# Altium schematic sheet 主控.SchDoc
size A3
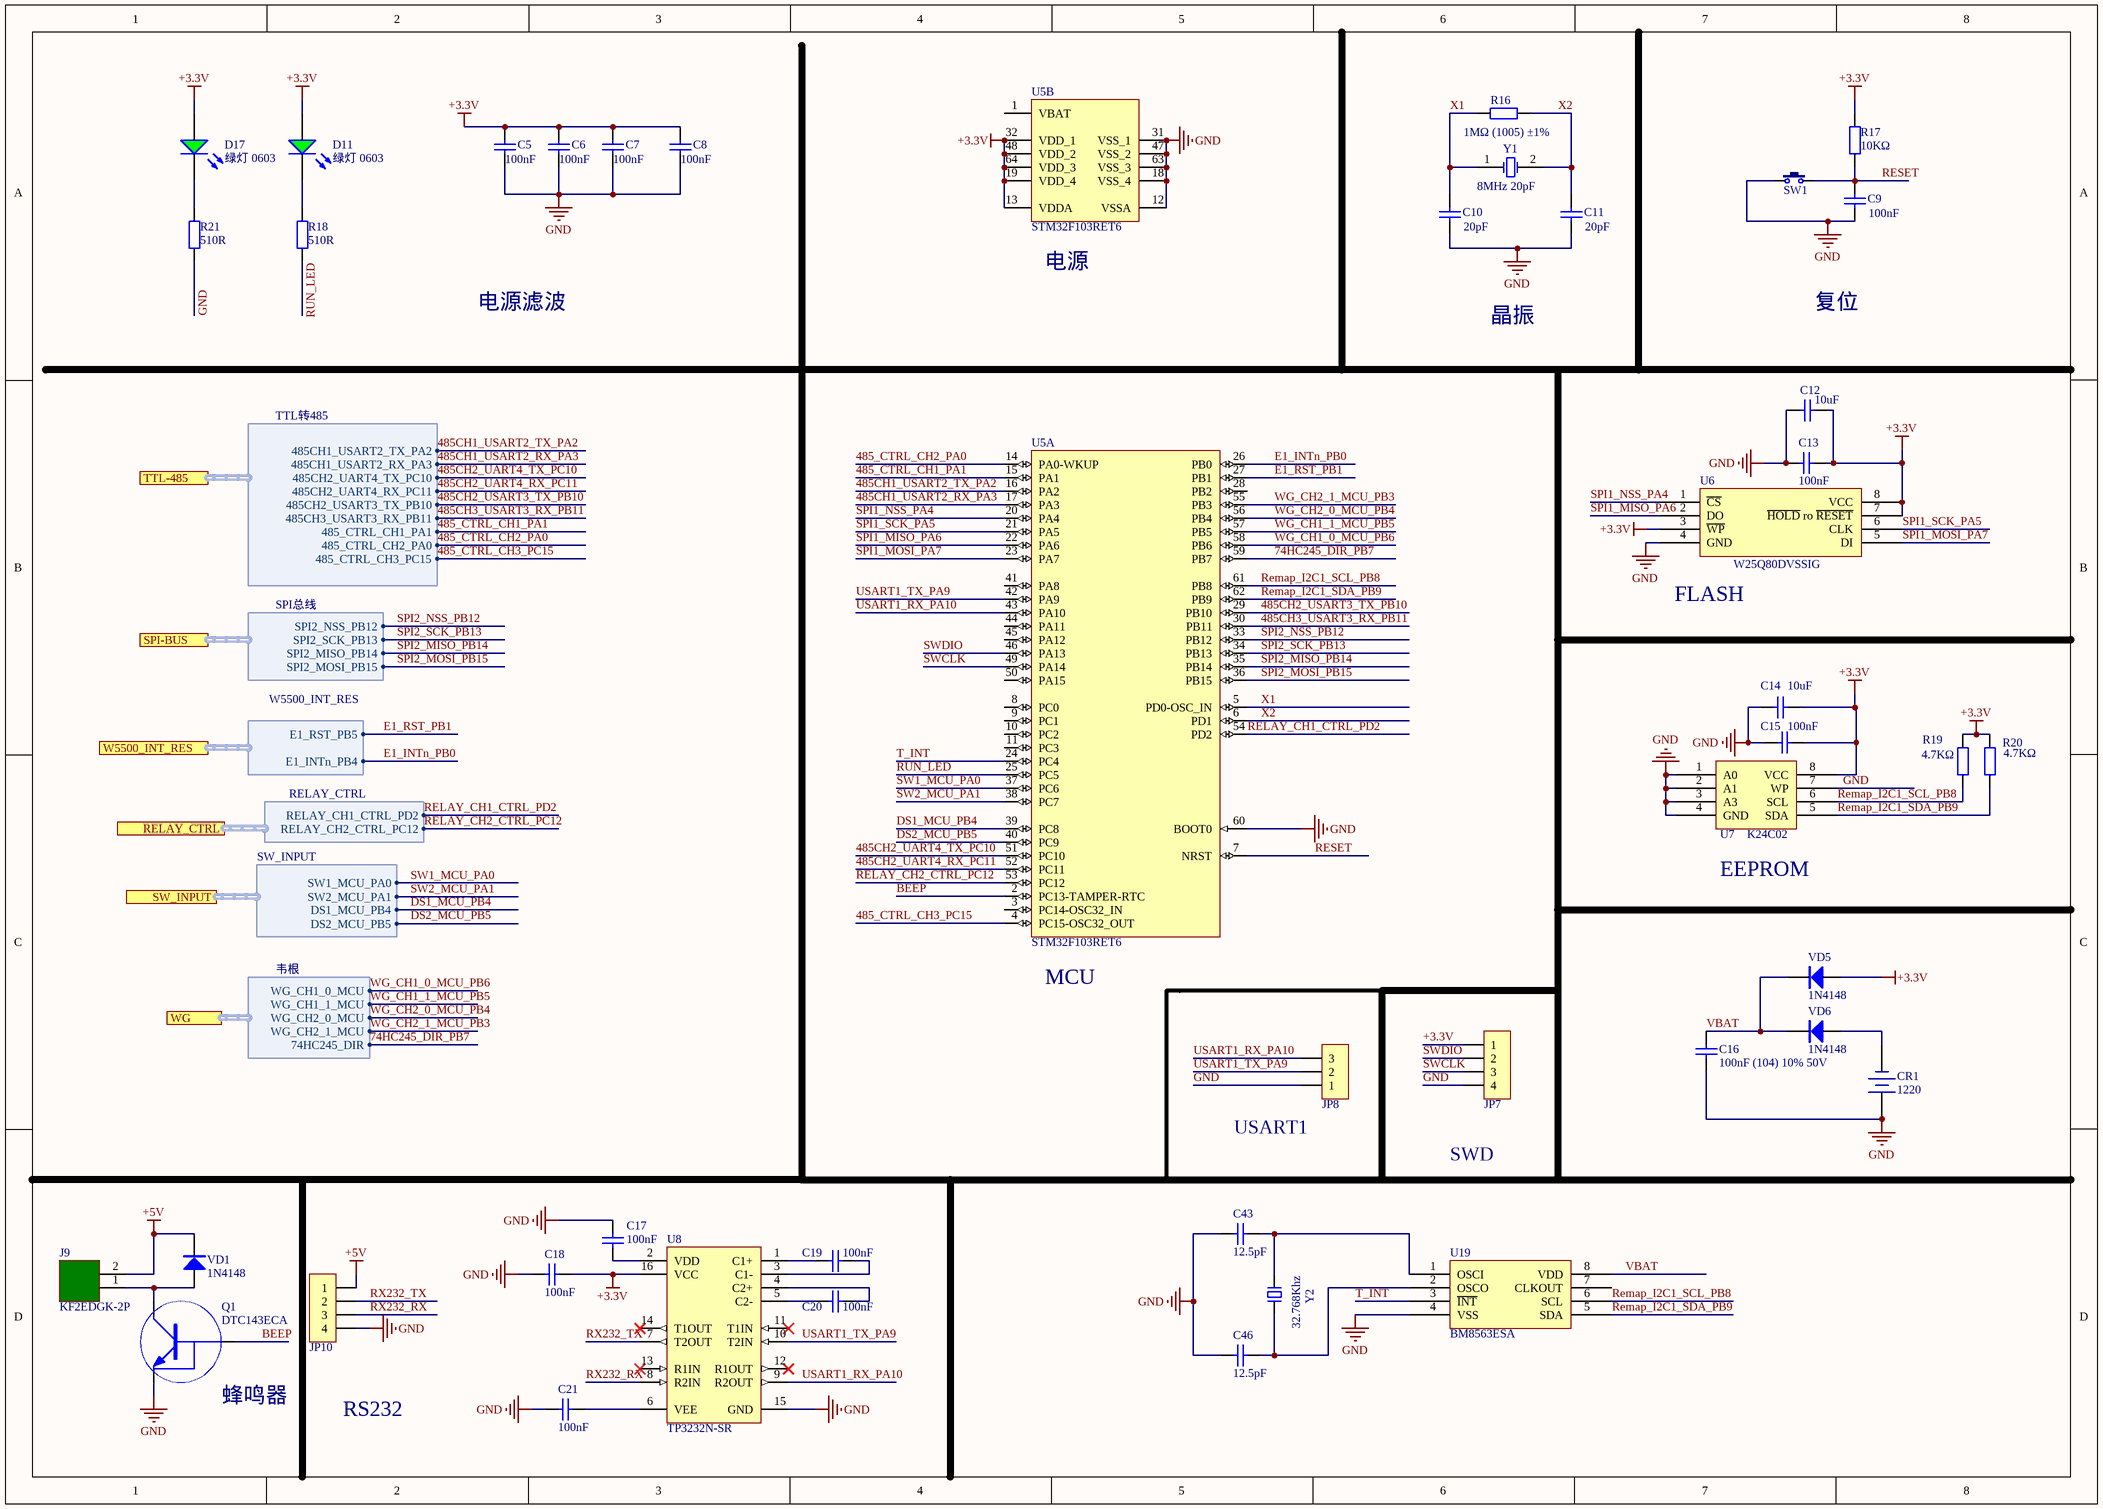
[diagram p0: 主控.SchDoc]

## Parts
C5  100nF  [0603_C]
C6  100nF  [0603_C]
C7  100nF  [0603_C]
C8  100nF  [0603_C]
C9  100nF  [0603_C]
C10  20pF  [0603_C]
C11  20pF  [0603_C]
C12  10uF  [0603_C]
C13  100nF  [0603_C]
C14  10uF  [0603_C]
C15  100nF  [0603_C]
C16  100nF (104) 10% 50V  [0603_C]
C17  100nF  [0603_C]
C18  100nF  [0603_C]
C19  100nF  [0603_C]
C20  100nF  [0603_C]
C21  100nF  [0603_C]
C43  12.5pF  [0603_C]
C46  12.5pF  [0603_C]
CR1  1220  [CR1220_A]
D11  绿灯 0603  [0603_LED_S1]
D17  绿灯 0603  [0603_LED_S1]
J9  KF2EDGK-2P  [KF2EDGK5.08W-2P]
JP7  HDR-1X4  [HDR-1X4_H]  (value not drawn)
JP8  HDR-1X3  [HDR-1X3_H]  (value not drawn)
JP10  HDR-1X4  [HDR-1X4]  (value not drawn)
Q1  DTC143ECA
R16  1MΩ (1005) ±1%  [0603_R]
R17  10KΩ  [0603_R]
R18  510R  [0603_R]
R19  4.7KΩ  [0603_R]
R20  4.7KΩ  [0603_R]
R21  510R  [0603_R]
SW1  3x6x5  [TSW SMD-3*6*4.3]  (value not drawn)
U5  STM32F103RET6  [LQFP-64_10x10x05P]  (parts A,B of 2)
U6  W25Q80DVSSIG  [SOIC-8_208mil]
U7  K24C02  [SOIC-8_150mil]
U8  TP3232N-SR  [SOIC-16_150mil]
U19  BM8563ESA  [SOIC-8_150mil]
VD1  1N4148  [MINI_MELF (LL34)]
VD5  1N4148  [MINI_MELF (LL34)]
VD6  1N4148  [MINI_MELF (LL34)]
Y1  8MHz 20pF  [XTAL-49S DIP]
Y2  32.768Khz  [XTAL-3215]

## Ports
RELAY_CTRL (harness RELAY_CTRL), SPI-BUS (harness SPI总线), SW_INPUT (harness SW_INPUT), TTL-485 (harness TTL转485), W5500_INT_RES (harness W5500_INT_RES), WG (harness 韦根)

## Harnesses
TTL转485: 485CH1_USART2_TX_PA2, 485CH1_USART2_RX_PA3, 485CH2_UART4_TX_PC10, 485CH2_UART4_RX_PC11, 485CH2_USART3_TX_PB10, 485CH3_USART3_RX_PB11, 485_CTRL_CH1_PA1, 485_CTRL_CH2_PA0, 485_CTRL_CH3_PC15
SPI总线: SPI2_NSS_PB12, SPI2_SCK_PB13, SPI2_MISO_PB14, SPI2_MOSI_PB15
W5500_INT_RES: E1_RST_PB5, E1_INTn_PB4
RELAY_CTRL: RELAY_CH1_CTRL_PD2, RELAY_CH2_CTRL_PC12
SW_INPUT: SW1_MCU_PA0, SW2_MCU_PA1, DS1_MCU_PB4, DS2_MCU_PB5
韦根: WG_CH1_0_MCU, WG_CH1_1_MCU, WG_CH2_1_MCU, 74HC245_DIR, WG_CH2_0_MCU

## Nets
+3.3V: C5.2 C6.2 C7.2 C8.2 C12.2 C13.1 C14.2 C15.1 C18.2 D11.A D17.A JP7.1 R17.1 R19.2 R20.2 U5.13(VDDA) U5.19(VDD_4) U5.32(VDD_1) U5.48(VDD_2) U5.64(VDD_3) U6.3(~{WP}) U6.7(~{HOLD}_ro_~{RESET}) U6.8(VCC) U7.8(VCC) U8.16(VCC) VD5.1(A)
+5V: J9.2 JP10.1 VD1.2(K)
GND: C5.1 C6.1 C7.1 C8.1 C9.1 C10.1 C11.1 C12.1 C13.2 C14.1 C15.2 C16.1 C17.2 C18.1 C21.1 C43.1 C46.1 CR1.1(DC+) JP7.4 JP8.1 JP10.4 Q1.2(GND) R21.1 SW1.1 U5.12(VSSA) U5.18(VSS_4) U5.31(VSS_1) U5.47(VSS_2) U5.60(BOOT0) U5.63(VSS_3) U6.4(GND) U7.1(A0) U7.2(A1) U7.3(A3) U7.4(GND) U7.7(WP) U8.15(GND) U19.4(VSS)
74HC245_DIR_PB7: U5.59(PB7) ; port WG.74HC245_DIR
485_CTRL_CH1_PA1: U5.15(PA1) ; port TTL-485.485_CTRL_CH1_PA1
485_CTRL_CH2_PA0: U5.14(PA0-WKUP) ; port TTL-485.485_CTRL_CH2_PA0
485_CTRL_CH3_PC15: U5.4(PC15-OSC32_OUT) ; port TTL-485.485_CTRL_CH3_PC15
485CH1_USART2_RX_PA3: U5.17(PA3) ; port TTL-485.485CH1_USART2_RX_PA3
485CH1_USART2_TX_PA2: U5.16(PA2) ; port TTL-485.485CH1_USART2_TX_PA2
485CH2_UART4_RX_PC11: U5.52(PC11) ; port TTL-485.485CH2_UART4_RX_PC11
485CH2_UART4_TX_PC10: U5.51(PC10) ; port TTL-485.485CH2_UART4_TX_PC10
485CH2_USART3_TX_PB10: U5.29(PB10) ; port TTL-485.485CH2_USART3_TX_PB10
485CH3_USART3_RX_PB11: U5.30(PB11) ; port TTL-485.485CH3_USART3_RX_PB11
BEEP: Q1.1(IN) U5.2(PC13-TAMPER-RTC)
DS1_MCU_PB4: U5.39(PC8) ; port SW_INPUT.DS1_MCU_PB4
DS2_MCU_PB5: U5.40(PC9)
E1_INTn_PB0: U5.26(PB0) ; port W5500_INT_RES.E1_INTn_PB4
E1_RST_PB1: U5.27(PB1) ; port W5500_INT_RES.E1_RST_PB5
RELAY_CH1_CTRL_PD2: U5.54(PD2) ; port RELAY_CTRL.RELAY_CH1_CTRL_PD2
RELAY_CH2_CTRL_PC12: U5.53(PC12) ; port RELAY_CTRL.RELAY_CH2_CTRL_PC12
Remap_I2C1_SCL_PB8: R19.1 U5.61(PB8) U7.6(SCL) U19.6(SCL)
Remap_I2C1_SDA_PB9: R20.1 U5.62(PB9) U7.5(SDA) U19.5(SDA)
RESET: C9.2 R17.2 SW1.2 U5.7(NRST)
RUN_LED: R18.1 U5.25(PC5)
RX232_RX: JP10.3 U8.8(R2IN)
RX232_TX: JP10.2 U8.7(T2OUT)
SPI1_MISO_PA6: U5.22(PA6) U6.2(DO)
SPI1_MOSI_PA7: U5.23(PA7) U6.5(DI)
SPI1_NSS_PA4: U5.20(PA4) U6.1(~{CS})
SPI1_SCK_PA5: U5.21(PA5) U6.6(CLK)
SPI2_MISO_PB14: U5.35(PB14) ; port SPI-BUS.SPI2_MISO_PB14
SPI2_MOSI_PB15: U5.36(PB15) ; port SPI-BUS.SPI2_MOSI_PB15
SPI2_NSS_PB12: U5.33(PB12) ; port SPI-BUS.SPI2_NSS_PB12
SPI2_SCK_PB13: U5.34(PB13) ; port SPI-BUS.SPI2_SCK_PB13
SW1_MCU_PA0: U5.37(PC6)
SW2_MCU_PA1: U5.38(PC7) ; port SW_INPUT.SW2_MCU_PA1
SWCLK: JP7.3 U5.49(PA14)
SWDIO: JP7.2 U5.46(PA13)
T_INT: U5.24(PC4) U19.3(~{INT})
USART1_RX_PA10: JP8.3 U5.43(PA10) U8.9(R2OUT)
USART1_TX_PA9: JP8.2 U5.42(PA9) U8.10(T2IN)
VBAT: C16.2 U19.8(VDD) VD5.2(K) VD6.2(K)
WG_CH1_0_MCU_PB6: U5.58(PB6) ; port WG.WG_CH1_0_MCU
WG_CH1_1_MCU_PB5: U5.57(PB5) ; port WG.WG_CH1_1_MCU
WG_CH2_0_MCU_PB4: U5.56(PB4) ; port WG.WG_CH2_0_MCU
WG_CH2_1_MCU_PB3: U5.55(PB3) ; port WG.WG_CH2_1_MCU
X1: C10.2 R16.1 U5.5(PD0-OSC_IN) Y1.1(OSC1)
X2: C11.2 R16.2 U5.6(PD1) Y1.2(OSC2)
NetC17_1: C17.1 U8.2(VDD)
NetC19_1: C19.1 U8.1(C1+)
NetC19_2: C19.2 U8.3(C1-)
NetC20_1: C20.1 U8.5(C2-)
NetC20_2: C20.2 U8.4(C2+)
NetC21_2: C21.2 U8.6(VEE)
NetC43_2: C43.2 U19.1(OSCI) Y2.1
NetC46_2: C46.2 U19.2(OSCO) Y2.2
NetCR1_2: CR1.2(DC-) VD6.1(A)
NetD11_K: D11.K R18.2
NetD17_K: D17.K R21.2
NetJ9_1: J9.1 Q1.3(OUT) VD1.1(A)

Not connected (* = marked no-connect by the designer): U5 1(VBAT) 3(PC14-OSC32_IN) 8(PC0) 9(PC1) 10(PC2) 11(PC3) 28(PB2) 41(PA8) 44(PA11) 45(PA12) 50(PA15); U8 11(T1IN)* 12(R1OUT)* 13(R1IN)* 14(T1OUT)*; U19 7(CLKOUT)

## Notes on the sheet
- 电源滤波
- (near U5) 电源
- 复位
- 晶振
- (near U6) FLASH
- (near U7) EEPROM
- (near U5) MCU
- (near JP8) USART1
- SWD
- (near Q1) 蜂鸣器
- RS232
- Labels drawn without touching a wire or pin: DS2_MCU_PB5, SW1_MCU_PA0

## Library data of the parts
C5-C9 C13 C15-C21 = 0603 100nF (104) 10% 50V: 贴片电容; ComponentLink1Description: 供应商链接; ComponentLink1URL: http://www.szlcsc.com/product/details_15331.html; Package: 0603; Supplier: LC; SuppliersPartNumber: C14663
C10 C11 = 0603 6pF (6R0) 0.25pF 50V: 贴片电容; ComponentLink1Description: 供应商链接; ComponentLink1URL: http://www.szlcsc.com/product/details_38453.html; Package: 0603; Supplier: LC; SuppliersPartNumber: C37474
C12 C14 = 0603 10uF (106) 10% 10V: 贴片电容; ComponentLink1Description: 供应商链接; ComponentLink1URL: http://www.szlcsc.com/product/details_20411.html; Package: 0603; Supplier: LC; SuppliersPartNumber: C19702
C43 C46 = 0603 12pF (120) 5% 50V: 贴片电容; ComponentLink1Description: 供应商链接; ComponentLink1URL: http://www.szlcsc.com/product/details_39506.html; Package: 0603; Supplier: LC; SuppliersPartNumber: C38523
CR1 = CR-3V: 微型电池; 版权归属: 源创客; BOM名称: 微型电池; 学习资源: www.ooocke.com
D11 D17 = 0603 绿灯: 发光二极管; ComponentLink1Description: 供应商链接; ComponentLink1URL: http://www.szlcsc.com/product/details_73152.html; Package: 0603; Supplier: LC; SuppliersPartNumber: C72043
JP7 JP10 = Header 4: 4P接插件; 版权归属: 源创客; BOM名称: 4P接插件; 学习资源: www.ooocke.com
JP8 = Header 3: 3P接插件; 版权归属: 源创客; BOM名称: 3P接插件; 学习资源: www.ooocke.com
Q1 = DTC143ECA: NPN集成三极管; ComponentLink1Description: 供应商; ComponentLink1URL: https://item.szlcsc.com/14526.html
R16 = 0603 10MΩ (1005) 1%: 贴片电阻; ComponentLink1Description: 供应商链接; ComponentLink1URL: http://www.szlcsc.com/product/details_7726.html; Package: 0603; Supplier: LC; SuppliersPartNumber: C7250
R17 = 0603 10KΩ (1002) 1%: 贴片电阻; ComponentLink1Description: 供应商链接; ComponentLink1URL: http://www.szlcsc.com/product/details_26547.html; Package: 0603; Supplier: LC; SuppliersPartNumber: C25804
R18 R21 = 0603 2KΩ (2001) 1%: 贴片电阻; ComponentLink1Description: 供应商链接; ComponentLink1URL: http://www.szlcsc.com/product/details_23702.html; Package: 0603; Supplier: LC; SuppliersPartNumber: C22975
R19 R20 = 0603 4.7KΩ (4701) 1%: 贴片电阻; ComponentLink1Description: 供应商链接; ComponentLink1URL: http://www.szlcsc.com/product/details_23889.html; Package: 0603; Supplier: LC; SuppliersPartNumber: C23162
SW1 = TSW 3x6: 3x6轻触开关; 版权归属: 源创客; BOM名称: 3x6轻触开关; 学习资源: www.ooocke.com
U5 = STM32F103RET6: ARM; ComponentLink1Description: 供应商链接; ComponentLink1URL: http://www.szlcsc.com/product/details_8814.html; Package: LQFP-64_10x10x05P; Supplier: LC; SuppliersPartNumber: C8322
U6 = W25Q128FVSIG: Flash ROM; ComponentLink1Description: 供应商链接; ComponentLink1URL: http://www.szlcsc.com/product/details_36072.html; Package: SOIC-8; Supplier: LC; SuppliersPartNumber: C35101; ComponentLink2Description: 华邦; ComponentLink2URL: https://item.szlcsc.com/14743.html
U7 = EEPROM/AT24C256C-SSHL-T: EEPROM; ComponentLink1Description: 供应商链接; ComponentLink1URL: http://www.szlcsc.com/product/details_6947.html; Package: SOIC-8_150mil; Supplier: LC; SuppliersPartNumber: C6482; ComponentLink2Description: 华虹宏力; ComponentLink2URL: https://item.szlcsc.com/84948.html
U8 = MAX232ESE: RS232; ComponentLink1Description: 供应商链接; ComponentLink1URL: http://www.szlcsc.com/product/details_27608.html; Package: SOIC-16_150mil; Supplier: LC; SuppliersPartNumber: C26860
U19 = PCF8563T/5,518: 实时时钟; ComponentLink1Description: 供应商链接; ComponentLink1URL: http://www.szlcsc.com/product/details_7917.html; Package: SOIC-8_150mil; Supplier: LC; SuppliersPartNumber: C7440; ComponentLink2Description: BL(上海贝岭); ComponentLink2URL: https://item.szlcsc.com/142290.html
VD1 VD5 VD6 = 1N4148: 高速开关二极管; 版权归属: 源创客; BOM名称: 高速开关二极管; 学习资源: www.ooocke.com
Y1 = SMD-5032_2P 8MHz 20ppm 20pF: 贴片晶振; ComponentLink1Description: 供应商链接; ComponentLink1URL: http://www.szlcsc.com/product/details_19261.html; Package: SMD-5032_2P; Supplier: LC; SuppliersPartNumber: C18560
Y2 = XTAL-2: 2脚晶振; 版权归属: 源创客; BOM名称: 2脚晶振; 学习资源: www.ooocke.com